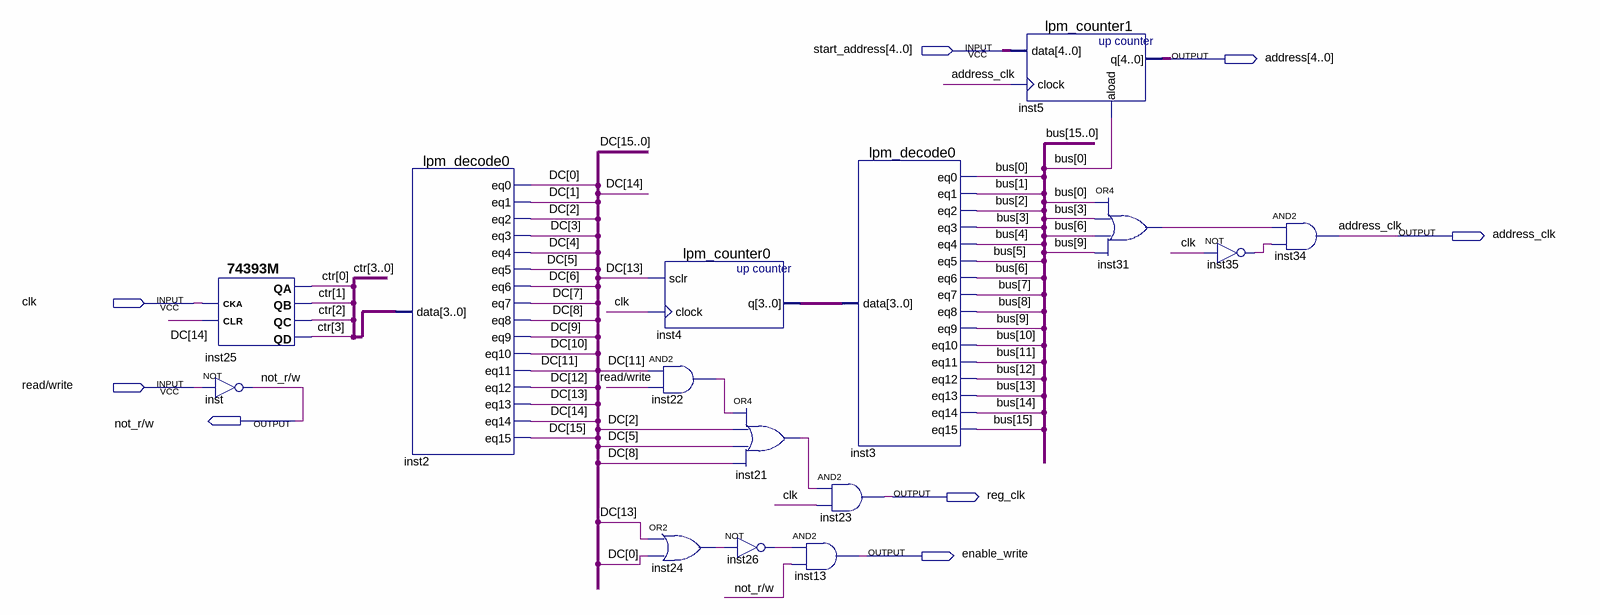
[diagram p0: schematic sheet]
// Quartus schematic LogicUnit.bdf as structural Verilog: 15 symbols, 8 pins
module LogicUnit (
  input  [4:0] start_address,
  input  clk,
  input  \read/write ,
  output [4:0] address,
  output address_clk,
  output \not_r/w ,
  output reg_clk,
  output enable_write
);

  wire inst21_out, inst22_out, inst24_out, inst26_out, inst31_out, inst35_out;
  wire [3:0] ctr, inst4_q;
  wire [15:0] bus, DC;

  \74393M  inst25 (.CLR(DC[14]), .CKA(clk), .QC(ctr[2]), .QD(ctr[3]), .QB(ctr[1]), .QA(ctr[0]));
  not inst (\not_r/w , \read/write );
  lpm_decode0 inst2 (
    .data(ctr), .eq0(DC[0]), .eq1(DC[1]), .eq2(DC[2]), .eq3(DC[3]), .eq4(DC[4]), .eq5(DC[5]), .eq6(DC[6]),
    .eq7(DC[7]), .eq8(DC[8]), .eq9(DC[9]), .eq10(DC[10]), .eq11(DC[11]), .eq12(DC[12]), .eq13(DC[13]),
    .eq14(DC[14]), .eq15(DC[15]));
  lpm_counter0 inst4 (.sclr(DC[13]), .clock(clk), .q(inst4_q));
  and inst22 (inst22_out, DC[11], \read/write );
  or inst24 (inst24_out, DC[13], DC[0]);
  or inst21 (inst21_out, inst22_out, DC[2], DC[5], DC[8]);
  not inst26 (inst26_out, inst24_out);
  and inst23 (reg_clk, inst21_out, clk);
  and inst13 (enable_write, inst26_out, \not_r/w );
  lpm_decode0 inst3 (
    .data(inst4_q), .eq0(bus[0]), .eq1(bus[1]), .eq2(bus[2]), .eq3(bus[3]), .eq4(bus[4]), .eq5(bus[5]),
    .eq6(bus[6]), .eq7(bus[7]), .eq8(bus[8]), .eq9(bus[9]), .eq10(bus[10]), .eq11(bus[11]), .eq12(bus[12]),
    .eq13(bus[13]), .eq14(bus[14]), .eq15(bus[15]));
  lpm_counter1 inst5 (.data(start_address), .clock(address_clk), .aload(bus[0]), .q(address));
  or inst31 (inst31_out, bus[0], bus[3], bus[6], bus[9]);
  not inst35 (inst35_out, clk);
  and inst34 (address_clk, inst31_out, inst35_out);
endmodule
